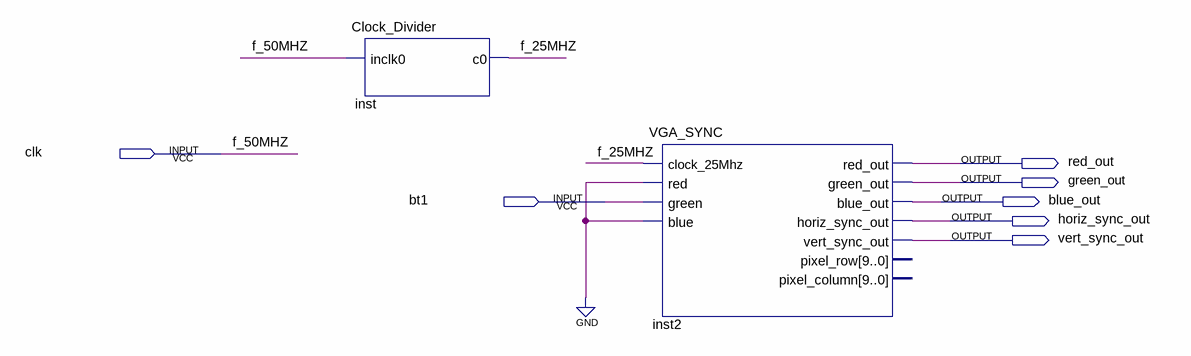
[diagram p0: schematic sheet]
// Quartus schematic FlappyBird.bdf as structural Verilog: 2 symbols, 7 pins
module FlappyBird (
  input  clk,
  input  bt1,
  output red_out,
  output green_out,
  output blue_out,
  output horiz_sync_out,
  output vert_sync_out
);

  wire f_25MHZ;

  Clock_Divider inst (.inclk0(clk), .c0(f_25MHZ));
  VGA_SYNC inst2 (
    .clock_25Mhz(f_25MHZ), .red(1'b0), .green(bt1), .blue(1'b0), .red_out(red_out), .green_out(green_out),
    .blue_out(blue_out), .horiz_sync_out(horiz_sync_out), .vert_sync_out(vert_sync_out));  // open: pixel_row, pixel_column

  // Other names for the same wires on the sheet: f_50MHZ = clk
endmodule
